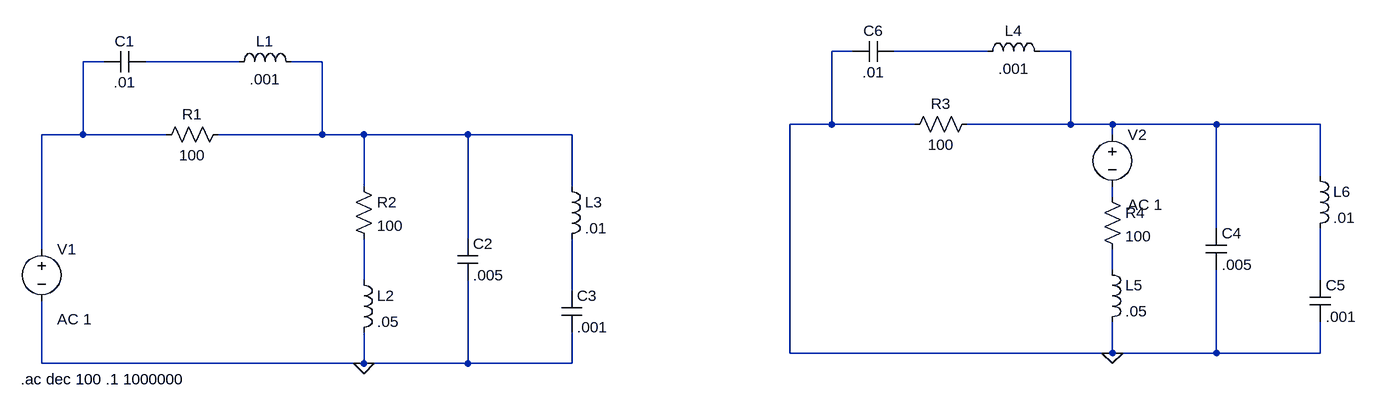
[diagram p0: schematic projet2circuits.asc]
projet2circuits.asc, the LTspice schematic file:
Version 4
SHEET 1 2080 680
WIRE 1296 -176 1264 -176
WIRE 1504 -176 1360 -176
WIRE 1632 -176 1584 -176
WIRE 144 -160 112 -160
WIRE 352 -160 208 -160
WIRE 480 -160 432 -160
WIRE 1264 -64 1264 -176
WIRE 1264 -64 1200 -64
WIRE 1392 -64 1264 -64
WIRE 1632 -64 1632 -176
WIRE 1632 -64 1472 -64
WIRE 1696 -64 1632 -64
WIRE 1856 -64 1696 -64
WIRE 2016 -64 1856 -64
WIRE 112 -48 112 -160
WIRE 112 -48 48 -48
WIRE 240 -48 112 -48
WIRE 480 -48 480 -160
WIRE 480 -48 320 -48
WIRE 544 -48 480 -48
WIRE 704 -48 544 -48
WIRE 864 -48 704 -48
WIRE 1696 -48 1696 -64
WIRE 2016 16 2016 -64
WIRE 544 32 544 -48
WIRE 864 32 864 -48
WIRE 1696 48 1696 32
WIRE 1856 96 1856 -64
WIRE 704 112 704 -48
WIRE 48 128 48 -48
WIRE 1696 160 1696 128
WIRE 544 176 544 112
WIRE 2016 176 2016 96
WIRE 864 192 864 112
WIRE 1200 288 1200 -64
WIRE 1696 288 1696 240
WIRE 1696 288 1200 288
WIRE 1856 288 1856 160
WIRE 1856 288 1696 288
WIRE 2016 288 2016 240
WIRE 2016 288 1856 288
WIRE 48 304 48 208
WIRE 544 304 544 256
WIRE 544 304 48 304
WIRE 704 304 704 176
WIRE 704 304 544 304
WIRE 864 304 864 256
WIRE 864 304 704 304
FLAG 544 304 0
FLAG 1696 288 0
SYMBOL voltage 48 112 R0
WINDOW 123 24 124 Left 2
WINDOW 39 0 0 Left 0
SYMATTR Value2 AC 1
SYMATTR InstName V1
SYMATTR Value ""
SYMBOL res 224 -32 R270
WINDOW 0 32 56 VTop 2
WINDOW 3 0 56 VBottom 2
SYMATTR InstName R1
SYMATTR Value 100
SYMBOL res 528 16 R0
SYMATTR InstName R2
SYMATTR Value 100
SYMBOL ind 336 -144 R270
WINDOW 0 32 56 VTop 2
WINDOW 3 5 56 VBottom 2
SYMATTR InstName L1
SYMATTR Value .001
SYMBOL ind 528 160 R0
SYMATTR InstName L2
SYMATTR Value .05
SYMBOL ind 848 16 R0
SYMATTR InstName L3
SYMATTR Value .01
SYMBOL cap 688 112 R0
SYMATTR InstName C2
SYMATTR Value .005
SYMBOL cap 848 192 R0
SYMATTR InstName C3
SYMATTR Value .001
SYMBOL cap 208 -176 R90
WINDOW 0 0 32 VBottom 2
WINDOW 3 32 32 VTop 2
SYMATTR InstName C1
SYMATTR Value .01
SYMBOL voltage 1696 -64 R0
WINDOW 123 24 124 Left 2
WINDOW 39 0 0 Left 0
SYMATTR Value2 AC 1
SYMATTR InstName V2
SYMATTR Value ""
SYMBOL res 1376 -48 R270
WINDOW 0 32 56 VTop 2
WINDOW 3 0 56 VBottom 2
SYMATTR InstName R3
SYMATTR Value 100
SYMBOL res 1680 32 R0
SYMATTR InstName R4
SYMATTR Value 100
SYMBOL ind 1488 -160 R270
WINDOW 0 32 56 VTop 2
WINDOW 3 5 56 VBottom 2
SYMATTR InstName L4
SYMATTR Value .001
SYMBOL ind 1680 144 R0
SYMATTR InstName L5
SYMATTR Value .05
SYMBOL ind 2000 0 R0
SYMATTR InstName L6
SYMATTR Value .01
SYMBOL cap 1840 96 R0
SYMATTR InstName C4
SYMATTR Value .005
SYMBOL cap 2000 176 R0
SYMATTR InstName C5
SYMATTR Value .001
SYMBOL cap 1360 -192 R90
WINDOW 0 0 32 VBottom 2
WINDOW 3 32 32 VTop 2
SYMATTR InstName C6
SYMATTR Value .01
TEXT 16 328 Left 2 !.ac dec 100 .1 1000000

The netlist it stands for:
* projet2circuits.asc
V1 N003 0 AC 1
R1 N003 N005 100
R2 N005 N008 100
L1 N004 N005 .001
L2 N008 0 .05
L3 N005 N010 .01
C2 N005 0 .005
C3 N010 0 .001
C1 N004 N003 .01
V2 N002 N006 AC 1
R3 0 N002 100
R4 N006 N007 100
L4 N001 N002 .001
L5 N007 0 .05
L6 N002 N009 .01
C4 N002 0 .005
C5 N009 0 .001
C6 N001 0 .01
.ac dec 100 .1 1000000
.backanno
.end